# Altium project PCM1792A.PrjPcb
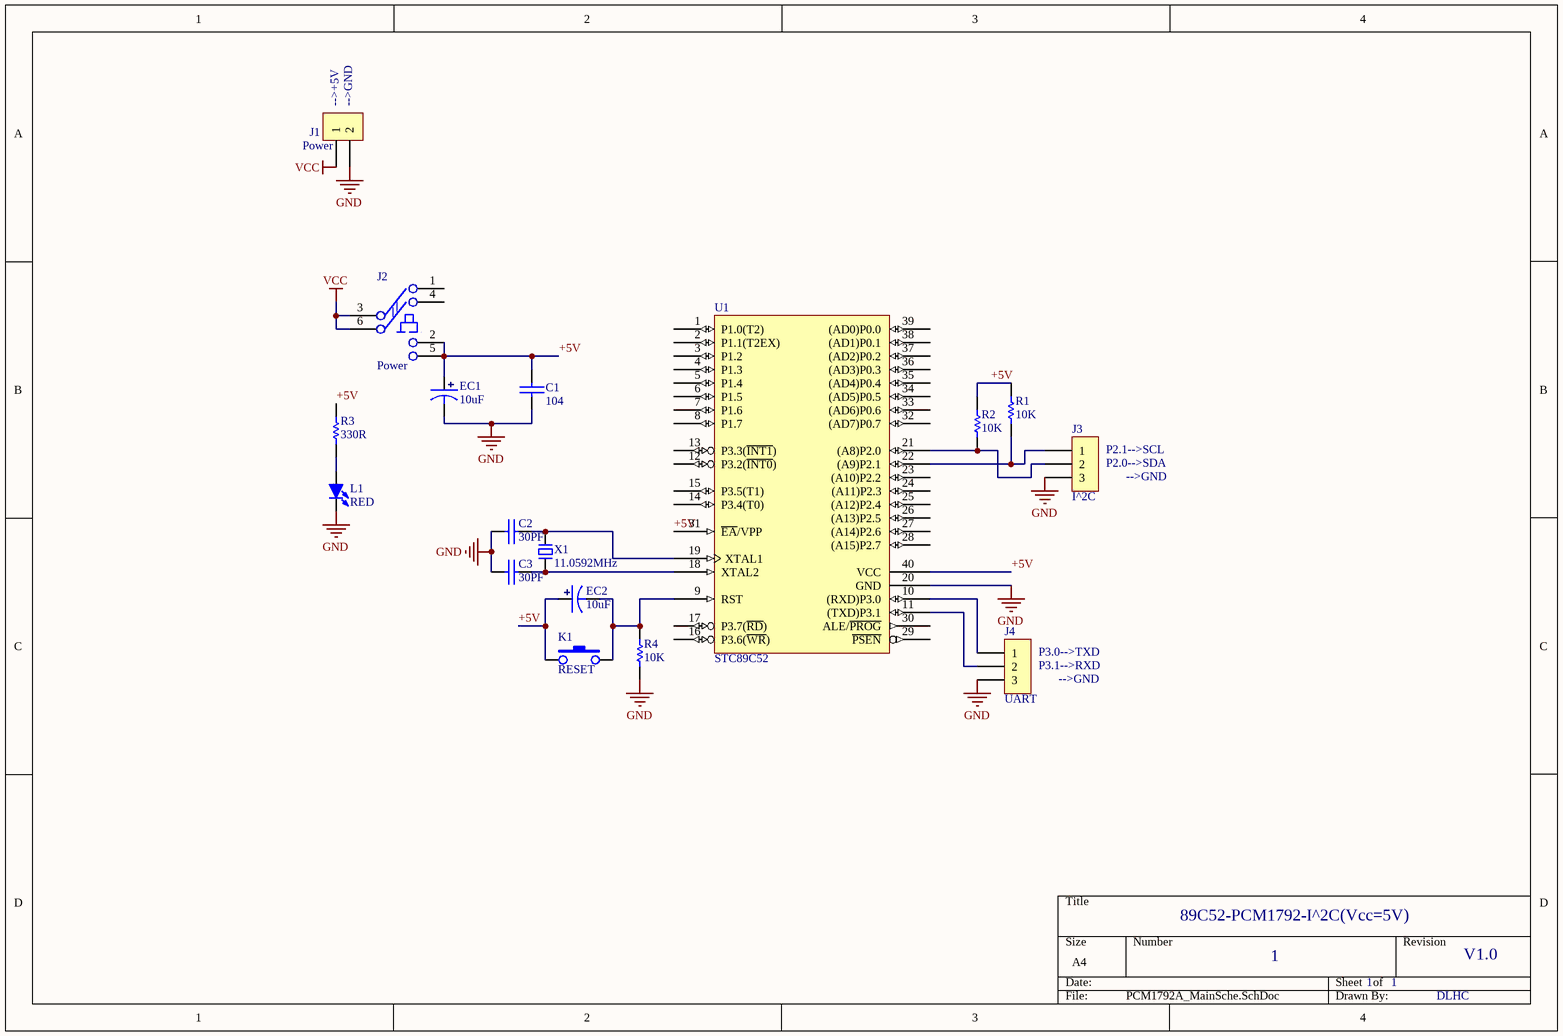
[diagram p0: PCM1792A_MainSche.SchDoc]
1 sheet, 17 parts. Net scope: global (net labels, ports and power ports of the same name join across sheets).

## Sheet PCM1792A_MainSche.SchDoc
size A4

### Parts
C1  104  [0201C]
C2  30PF  [0201C]
C3  30PF  [0201C]
EC1  10uF  [DIP-EC1.5X4X8]
EC2  10uF  [DIP-EC1.5X4X8]
J1  Power  [Pin HDR1X2/2.54mm-S]
J2  Power  [KFT DIP-8X8]
J3  I^2C  [Pin HDR1X3/2.54mm-S]
J4  UART  [Pin HDR1X3/2.54mm-S]
K1  RESET  [DIP-3X6X4.3]
L1  RED  [LED_A1]
R1  10K  [0201R]
R2  10K  [0201R]
R3  330R  [0201R]
R4  10K  [0201R]
U1  STC89C52  [DIP40]
X1  11.0592MHz  [OSC HC-49S]

### Nets
GND: C1.1 C2.1 C3.1 EC1.2 J1.2 J3.3 J4.3 L1.2(K) R4.1 U1.20(GND)
VCC: J1.1 J2.3 J2.6
+5V: C1.2 EC1.1 EC2.1 J2.2 J2.5 K1.1 R1.2 R2.2 R3.2 U1.31(~{EA}/VPP) U1.40(VCC)
NetC2_2: C2.2 U1.19(XTAL1) X1.2
NetC3_2: C3.2 U1.18(XTAL2) X1.1
NetEC2_2: EC2.2 K1.3 R4.2 U1.9(RST)
NetJ3_1: J3.1 R1.1 U1.22((A9)P2.1)
NetJ3_2: J3.2 R2.1 U1.21((A8)P2.0)
NetJ4_1: J4.1 U1.10((RXD)P3.0)
NetJ4_2: J4.2 U1.11((TXD)P3.1)
NetL1_1: L1.1(A) R3.1

Not connected (* = marked no-connect by the designer): J2 1 4; U1 1(P1.0(T2)) 2(P1.1(T2EX)) 3(P1.2) 4(P1.3) 5(P1.4) 6(P1.5) 7(P1.6) 8(P1.7) 12(P3.2(~{INT0})) 13(P3.3(~{INT1})) 14(P3.4(T0)) 15(P3.5(T1)) 16(P3.6(~{WR})) 17(P3.7(~{RD})) 23((A10)P2.2) 24((A11)P2.3) 25((A12)P2.4) 26((A13)P2.5) 27((A14)P2.6) 28((A15)P2.7) 29(~{PSEN}) 30(ALE/~{PROG}) 32((AD7)P0.7) 33((AD6)P0.6) 34((AD5)P0.5) 35((AD4)P0.4) 36((AD3)P0.3) 37((AD2)P0.2) 38((AD1)P0.1) 39((AD0)P0.0)

### Notes on the sheet
- (near J1) -->+5V
- (near J1) -->GND
- (near J3) P2.0-->SDA
- (near J3) P2.1-->SCL
- -->GND
- (near J4) P3.0-->TXD
- (near J4) P3.1-->RXD
- 89C52-PCM1792-I^2C(Vcc=5V)
- 1
- V1.0
- DLHC

### Library data of the parts
C1-C3 = CAP: 无极性电容
EC1 EC2 = DIP_ECAP: 直插电解电容
J1 = Pin HDR1X2
J2 = KEY-SL: 自锁开关; 淘宝ID: 小糖豆的小窝窝; BOM名称: 自锁开关; 下单链接: https://item.taobao.com/item.htm?ft=t&id=613637044352
J3 J4 = Pin HDR1X3
K1 = KEY
L1 = LED: 发光二极管; 淘宝ID: 小糖豆的小窝窝; BOM名称: 发光二极管; 下单链接: https://item.taobao.com/item.htm?ft=t&id=613637044352
R1-R4 = RES
X1 = XTAL-2P: 2脚无源脚晶振